# Altium schematic sheet EntradaDigital.SchDoc
size A4; SheetNumber: 4; SheetTotal: 6
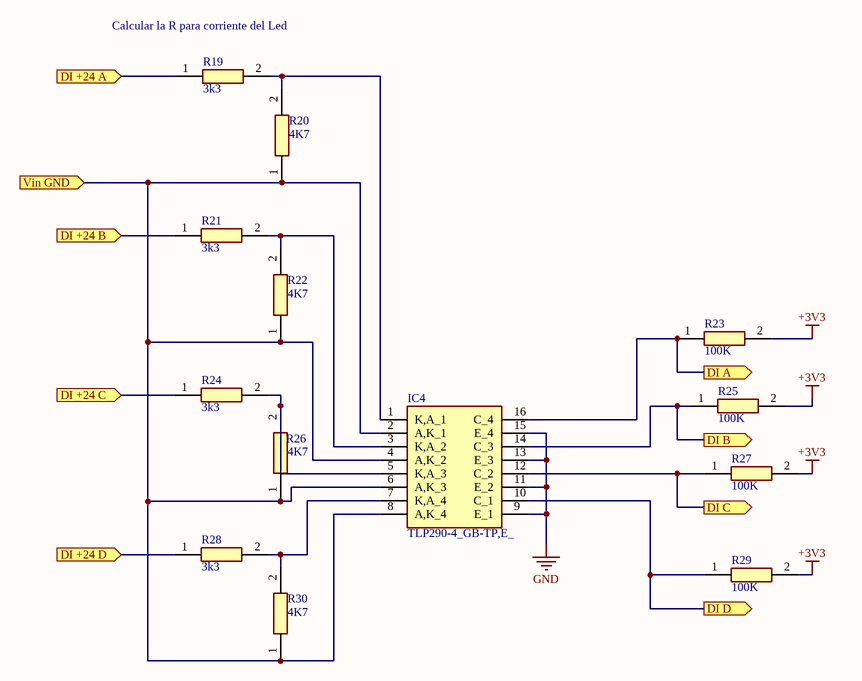
[diagram p0: EntradaDigital.SchDoc]

## Parts
IC4  TLP290-4_GB-TP,E_  [SOIC127P700X230-16N]
R19  3k3  [RESC3216X75N]
R20  4K7  [RESC3216X75N]
R21  3k3  [RESC3216X75N]
R22  4K7  [RESC3216X75N]
R23  100K  [RESC3216X75N]
R24  3k3  [RESC3216X75N]
R25  100K  [RESC3216X75N]
R26  4K7  [RESC3216X75N]
R27  100K  [RESC3216X75N]
R28  3k3  [RESC3216X75N]
R29  100K  [RESC3216X75N]
R30  4K7  [RESC3216X75N]

## Ports
DI +24 A (in), DI +24 B (in), DI +24 C (in), DI +24 D (in), DI A (out), DI B (out), DI C (out), DI D (out), Vin GND (in)

## Nets
+3V3: R23.2 R25.2 R27.2 R29.2
GND: IC4.9(E_1) IC4.11(E_2) IC4.13(E_3) IC4.15(E_4)
DI +24 A: R19.1 ; port DI +24 A
DI +24 B: R21.1 ; port DI +24 B
DI +24 C: R24.1 ; port DI +24 C
DI +24 D: R28.1 ; port DI +24 D
DI A: IC4.16(C_4) R23.1 ; port DI A
DI B: IC4.14(C_3) R25.1 ; port DI B
DI C: IC4.12(C_2) R27.1 ; port DI C
DI D: IC4.10(C_1) R29.1 ; port DI D
Vin GND: IC4.2(A,K_1) IC4.4(A,K_2) IC4.6(A,K_3) IC4.8(A,K_4) R20.1 R22.1 R26.1 R30.1 ; port Vin GND
NetIC4_1: IC4.1(K,A_1) R19.2 R20.2
NetIC4_3: IC4.3(K,A_2) R21.2 R22.2
NetIC4_5: IC4.5(K,A_3) R24.2 R26.2
NetIC4_7: IC4.7(K,A_4) R28.2 R30.2

## Notes on the sheet
- (near R19) Calcular la R para corriente del Led

## Library data of the parts
IC4 = TLP290-4_GB-TP,E_: Integrated Circuit; Manufacturer_Name: Toshiba; Manufacturer_Part_Number: TLP290-4(GB-TP,E); Datasheet Link: https://toshiba.semicon-storage.com/info/docget.jsp?did=12855&prodName=TLP290-4; Height: 2.3mm; Mouser Part Number: 757-TLP2904GBTPE; Mouser Price/Stock: https://www.mouser.co.uk/ProductDetail/Toshiba/TLP290-4GB-TPE?qs=aT3ZFlnUjmIQi4O%252BmonOug%3D%3D; Arrow Part Number: TLP290-4(GB-TP,E); Arrow Price/Stock: https://www.arrow.com/en/products/tlp290-4-gb-tpe/toshiba?region=nac
R19-R30 = CR1206-F_-2R00ELF: Resistor; Manufacturer_Name: Bourns; Manufacturer_Part_Number: CR1206-F/-2R00ELF; Height: 0.75mm; Mouser Part Number: 652-CR1206-F/2R00ELF; Mouser Price/Stock: https://www.mouser.co.uk/ProductDetail/Bourns/CR1206-F-2R00ELF?qs=W%2FMpXkg%252BdQ47Z%2FeZv1nDSg%3D%3D